# Altium schematic sheet Input Logic.SchDoc
size Letter; Organization: Penn Electric Racing; Address1: 220 S. 33rd St; Address2: Towne Bldg B11; Address3: Philadelpia, PA 19104; Address4: USA
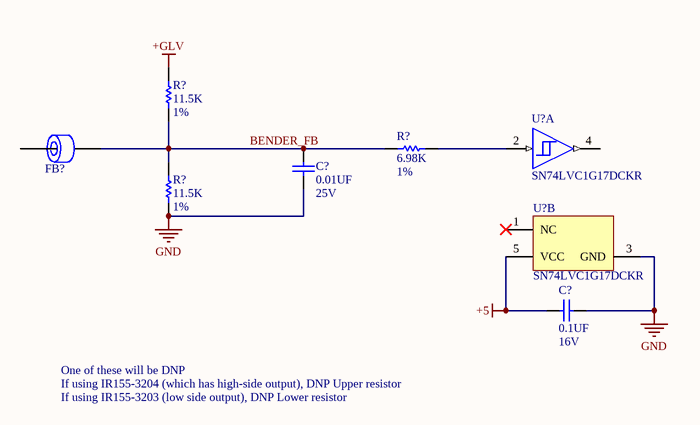
[diagram p0: Input Logic.SchDoc]

## Parts
(Parts that share a designator on the sheet are numbered #1, #2 ... from top to bottom, then left to right.)
C?#1  Val: 0.01UF  Vol: 25V  [0603_CAP]  (hidden comment: CAP 0603 0.01UF 25V 10% X7R)
C?#2  Val: 0.1UF  Vol: 16V  [0603_CAP]  (hidden comment: CAP 0603 0.1UF 16V 10% X7R)
FB?  Ferrite Chip 2500 Ohms  [0603]  (value not drawn)
R?#1  Val: 11.5K  Tol: 1%  [0603_RES]  (hidden comment: RES 0603 11.5K 1%)
R?#2  Val: 6.98K  Tol: 1%  [0603_RES]  (hidden comment: RES 0603 6.98K 1%)
R?#3  Val: 11.5K  Tol: 1%  [0603_RES]  (hidden comment: RES 0603 11.5K 1%)
U?#1  SN74LVC1G17DCKR  [DCK0005A_L]  (part A of 2)
U?#2  SN74LVC1G17DCKR  [DCK0005A_L]  (part B of 2)

## Nets
+5: C?#2.1 U?#2.5(VCC)
+GLV: R?#1.2
GND: C?#1.1 C?#2.2 R?#3.1 U?#2.3(GND)
BENDER_FB: C?#1.2 FB?.2 R?#1.1 R?#2.2 R?#3.2
NetR?#2_1: R?#2.1 U?#1.2(A)

Not connected (* = marked no-connect by the designer): FB? 1; U?#1 4(Y); U?#2 1(NC)*

## Notes on the sheet
- One of these will be DNP
- If using IR155-3204 (which has high-side output), DNP Upper resistor
- If using IR155-3203 (low side output), DNP Lower resistor
- Title:
- Size:
- Date:
- Desc:
- Letter
- Auth:
- Sheet
- Proj:
- *
- of
- www.uvmaero.org
- File:

## Library data of the parts
C?#1 = CAP 0603 0.01UF 25V 10% X7R: Capacitor Surface Mount 0603 Footprint 0.01UF 25V 10% Tolerance Ceramic X7R; Manufacturer: Various; PCB Package: 0603; Description in Visual: Cap SMT 0603 0.01UF 25V 10%  Cer X7R; P/N: CAP 0603 0.01UF 25V 10% X7R; Manufacturer P/N: Various; Value: 0.01UF; Voltage: 25V; Tolerance: 10%; Type: Ceramic X7R; ComponentLink1Description: Manufacturer Website; ComponentLink2Description: Component Datasheet; ComponentLink3Description: Octopart Link
C?#2 = CAP 0603 0.1UF 16V 10% X7R: Capacitor Surface Mount 0603 Footprint 0.1UF 16V 10% Tolerance Ceramic X7R; Manufacturer: Various; PCB Package: 0603; Description in Visual: Cap SMT 0603 0.1UF 16V 10%  Cer X7R; P/N: CAP 0603 0.1UF 16V 10% X7R; Manufacturer P/N: Various; Value: 0.1UF; Voltage: 16V; Tolerance: 10%; Type: Ceramic X7R; ComponentLink1Description: Manufacturer Website; ComponentLink2Description: Component Datasheet; ComponentLink3Description: Octopart Link
FB? = MMZ1608A252B: Ferrite Chip 200 mA 2500 Ohms Differential Mode - Single 0603 Footprint; Manufacturer: TDK; Description in Visual: Ferrite SMT 200mA 2500Ohm Dif Mode 0603; Usage: Signal Line; Current (mA): 200; Frequency: 100 MHz; Impedance at Freq (ohms): 2500; DC Resistance (ohms): 0.8; P/N: MMZ1608A252B; Manufacturer P/N: MMZ1608A252B; Filter type: Differential Mode - Single; Operating Temperature Range: -55 to +125 °C; PCB Package: 0603; ComponentLink1Description: Manufacturer Website; ComponentLink1URL: http://www.tdk.com/; ComponentLink2Description: Component Datasheet; ComponentLink2URL: http://www.tdk.co.jp/tefe02/e9412_mmz1608.pdf; ComponentLink3Description: Octopart Link; ComponentLink3URL: http://octopart.com/partsearch/#search/requestData&q=MMZ1608A252B
R?#1 R?#3 = RES 0603 11.5K 1%: Resistor Surface Mount, 11.5K Ohms, 0603 Footprint, 1% Tolerance 0.1W; Manufacturer: Various; PCB Package: 0603; Description in Visual: Res SMT 11.5K 0603  1%  0.1W; P/N: RES 0603 11.5K 1%; Manufacturer P/N: Various; Value: 11.5K; Power_Rating: 0.1W; Tolerance: 1%
R?#2 = RES 0603 6.98K 1%: Resistor Surface Mount, 6.98K Ohms, 0603 Footprint, 1% Tolerance 0.1W; Manufacturer: Various; PCB Package: 0603; Description in Visual: Res SMT 6.98K 0603  1%  0.1W; P/N: RES 0603 6.98K 1%; Manufacturer P/N: Various; Value: 6.98K; Power_Rating: 0.1W; Tolerance: 1%
U?#1 U?#2 = CMP-0859-00388-4: Single Schmitt-Trigger Buffer, DCK0005A, LARGE T&R; Manufacturer: Texas Instruments; tpd @ Nom Voltage(Max)(ns): 11,6.5,5.5,5; Bits(#): 1; VCC(Min)(V): 1.65; F @ Nom Voltage(Max)(Mhz): 150; VCC(Max)(V): 5.5; Input Type: CMOS/TTL; Sub-Family: Non-Inverting Buffer/Driver; Output Type: CMOS; Output Drive (IOL/IOH)(Max)(mA): 32/-32; 3-State Output: No; Logic: True; ICC @ Nom Voltage(Max)(mA): 0.01; Voltage(Nom)(V): 1.8,2.5,3.3,5; Rating: Catalog; Schmitt Trigger: Yes; Technology Family: LVC; PackageReference: DCK0005A; DatasheetVersion: SCES351V; Generic Part Number: SN74LVC1G17; Operating Temperature Range(C): -40 to 125,-40 to 85